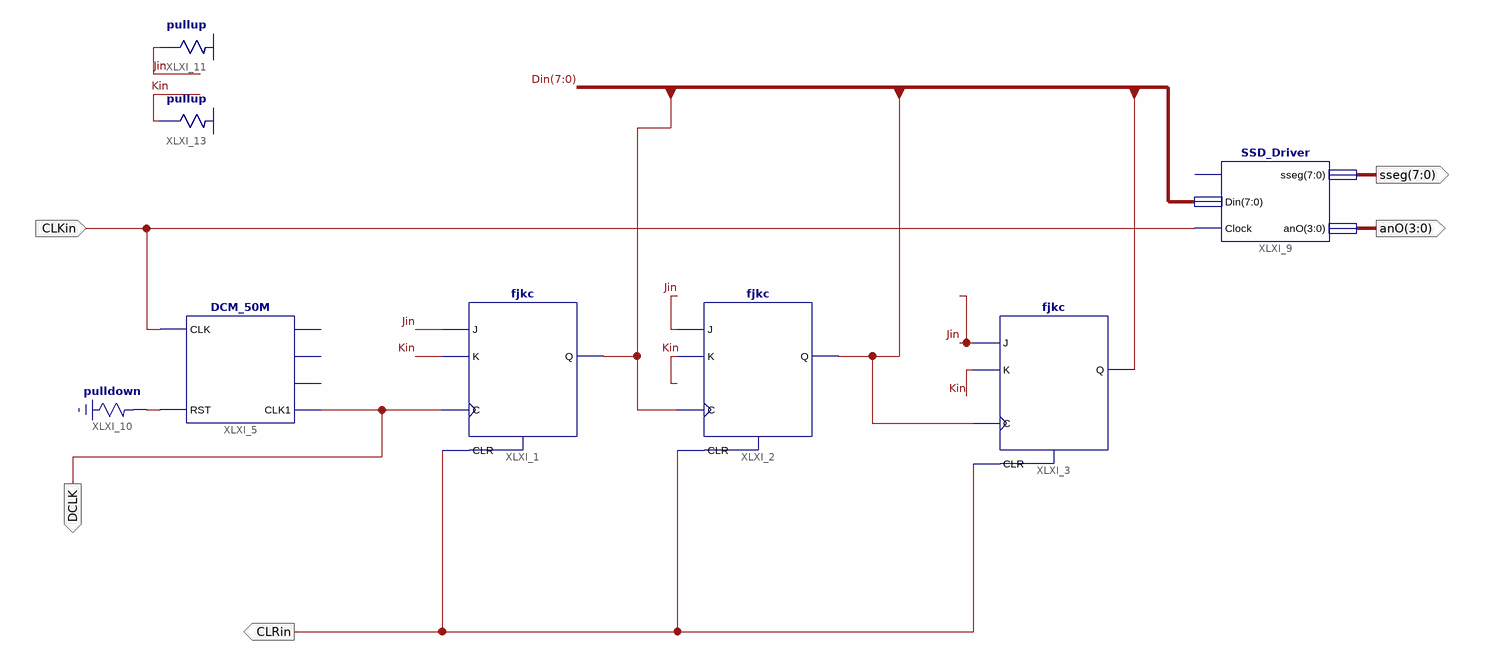
[diagram p0: schematic sheet 1]
// Xilinx ISE schematic OneShotCounter.sch (spartan3e) as structural Verilog: 8 symbols, 5 ports
module OneShotCounter (
  input  CLKin,
  output [7:0] sseg,
  output [3:0] anO,
  output DCLK,
  output CLRin
);

  wire Jin, Kin, XLXN_72;
  wire [7:0] Din;

  fjkc XLXI_1 (.C(DCLK), .CLR(CLRin), .J(Jin), .K(Kin), .Q(Din[0]));
  fjkc XLXI_2 (.C(Din[0]), .CLR(CLRin), .J(Jin), .K(Kin), .Q(Din[1]));
  fjkc XLXI_3 (.C(Din[1]), .CLR(CLRin), .J(Jin), .K(Kin), .Q(Din[2]));
  DCM_50M XLXI_5 (.CLK(CLKin), .RST(XLXN_72), .CLK1(DCLK));  // open: CLK1M, CLK10k, CLK1k
  SSD_Driver XLXI_9 (.Din(Din), .Clock(CLKin), .sseg(sseg), .anO(anO));  // open: En
  \pulldown  XLXI_10 (.O(XLXN_72));
  \pullup  XLXI_11 (.O(Jin));
  \pullup  XLXI_13 (.O(Kin));
endmodule
